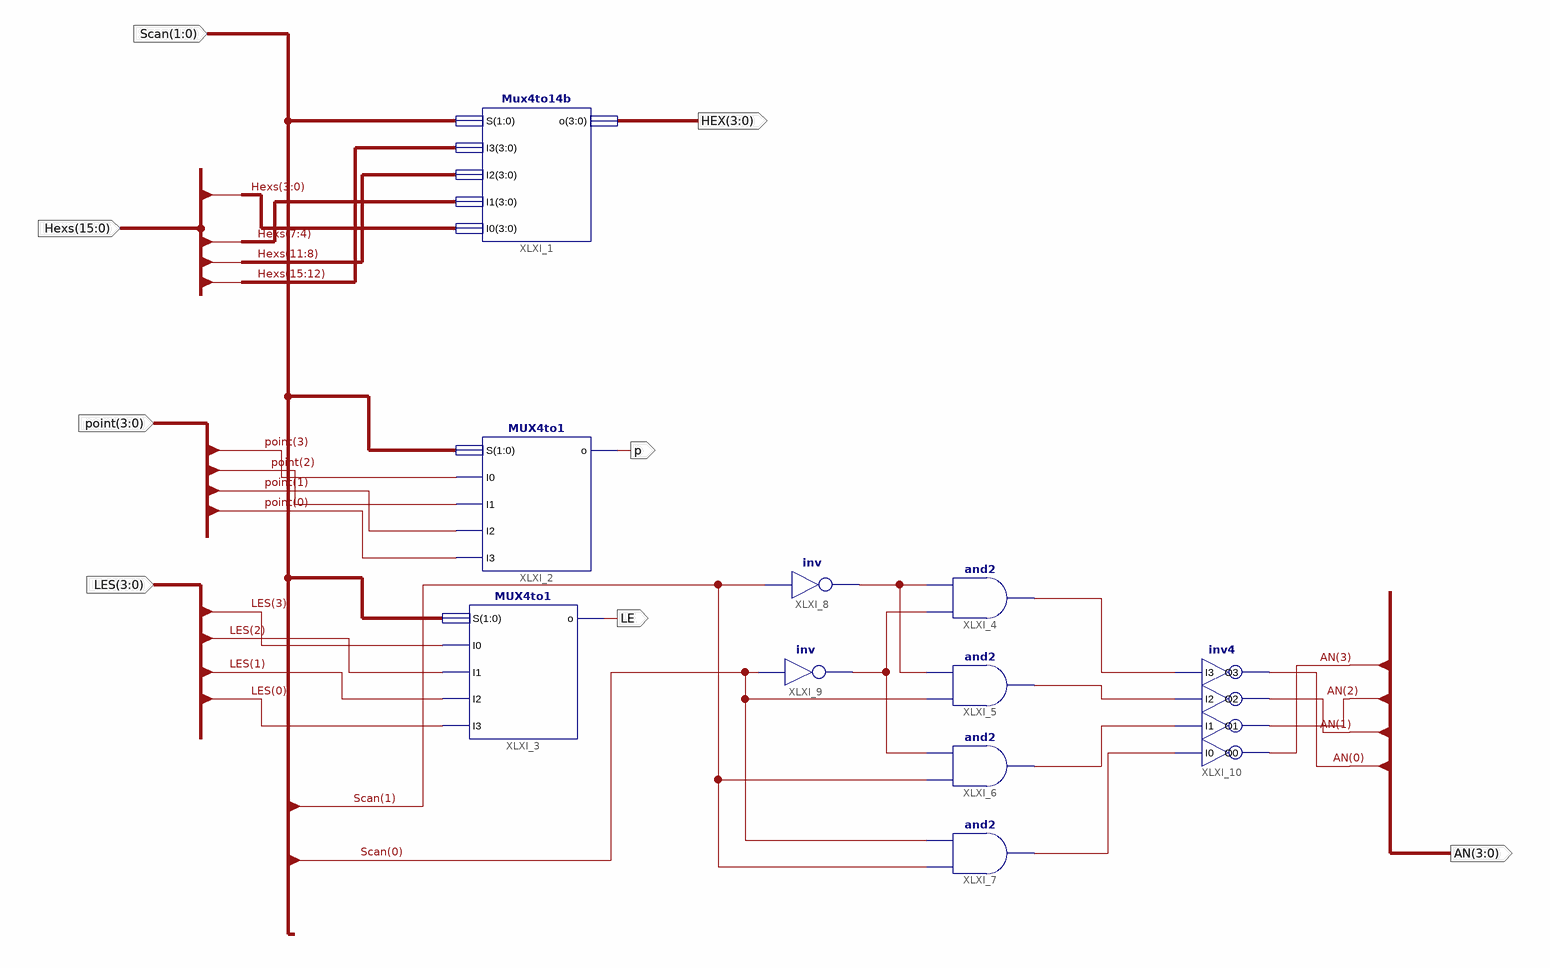
[diagram p0: schematic sheet 1]
// Xilinx ISE schematic DisplaySync.sch (kintex7) as structural Verilog: 10 symbols, 8 ports
module DisplaySync (
  input  [1:0] Scan,
  input  [15:0] Hexs,
  input  [3:0] point,
  input  [3:0] LES,
  output [3:0] HEX,
  output p,
  output LE,
  output [3:0] AN
);

  wire XLXN_30, XLXN_32, XLXN_36, XLXN_37, XLXN_38, XLXN_39;

  Mux4to14b XLXI_1 (.S(Scan), .I3(Hexs[15:12]), .I2(Hexs[11:8]), .I1(Hexs[7:4]), .I0(Hexs[3:0]), .o(HEX));
  MUX4to1 XLXI_2 (.S(Scan), .I0(point[3]), .I1(point[2]), .I2(point[1]), .I3(point[0]), .o(p));
  MUX4to1 XLXI_3 (.S(Scan), .I0(LES[3]), .I1(LES[2]), .I2(LES[1]), .I3(LES[0]), .o(LE));
  and XLXI_4 (XLXN_36, XLXN_30, XLXN_32);
  and XLXI_5 (XLXN_37, Scan[0], XLXN_32);
  and XLXI_6 (XLXN_38, Scan[1], XLXN_30);
  and XLXI_7 (XLXN_39, Scan[1], Scan[0]);
  not XLXI_8 (XLXN_32, Scan[1]);
  not XLXI_9 (XLXN_30, Scan[0]);
  inv4 XLXI_10 (.I0(XLXN_39), .I1(XLXN_38), .I2(XLXN_37), .I3(XLXN_36), .O0(AN[3]), .O1(AN[2]), .O2(AN[1]), .O3(AN[0]));
endmodule
